# Altium project cyberlamp.PrjPcb
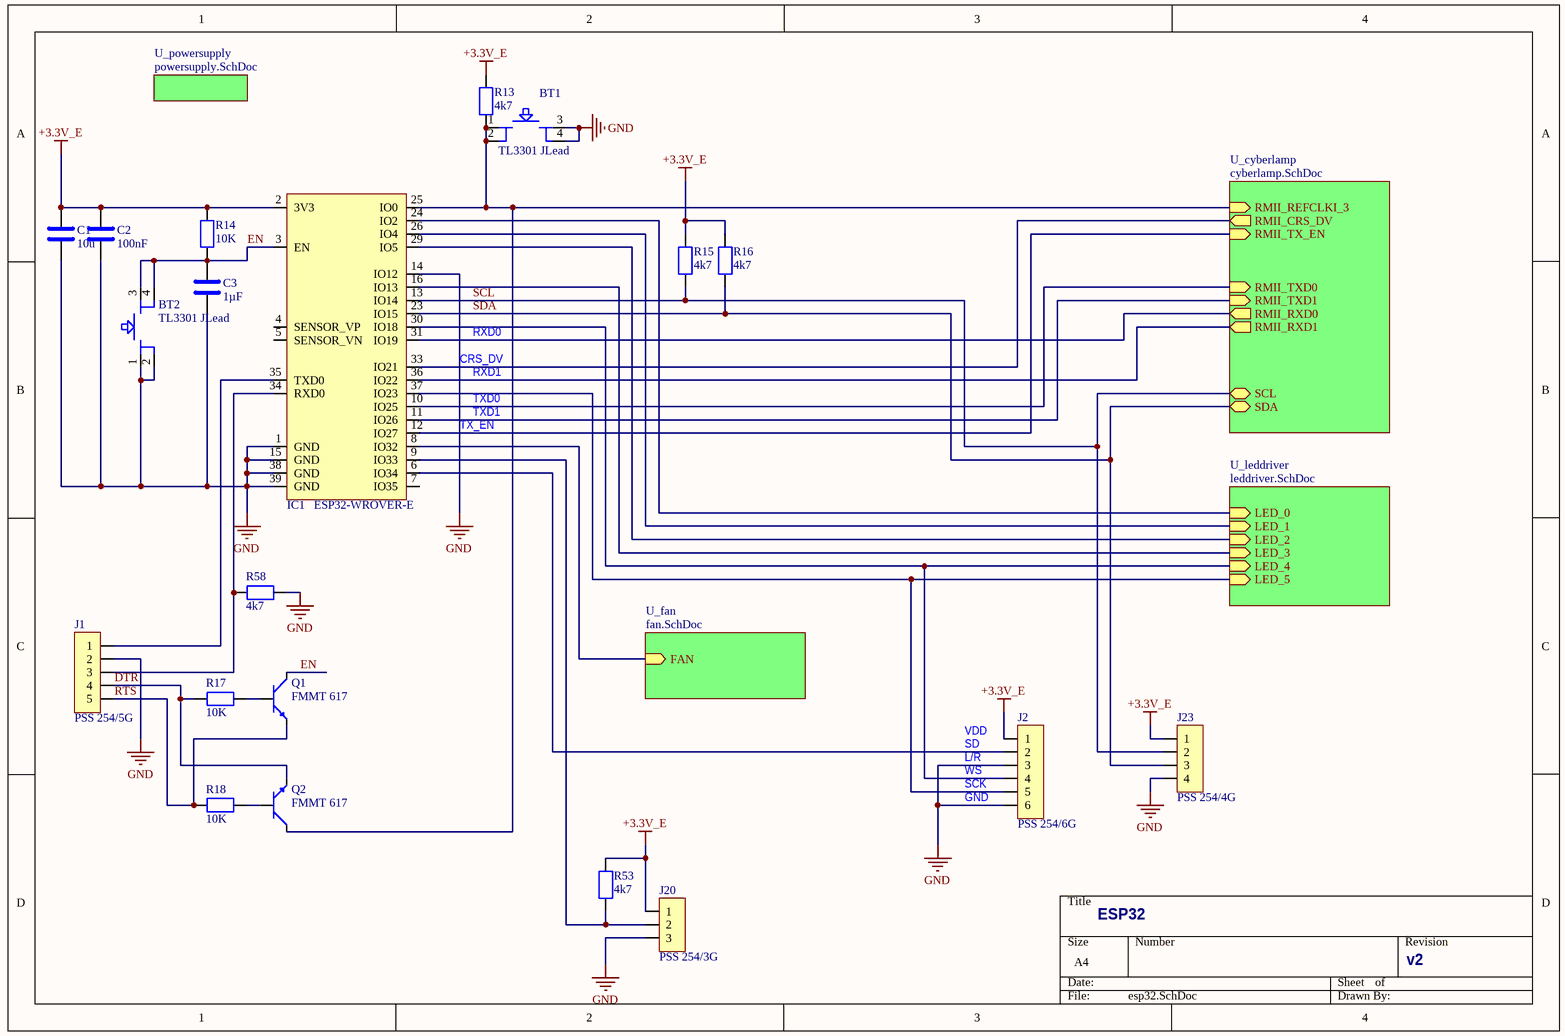
[diagram p0: esp32.SchDoc]
5 sheets, 173 parts. Net scope: hierarchical (ports join the sheet entries above them; power ports are global).
Board file: cyberlamp.PcbDoc
Sheets:
  esp32.SchDoc
    U_cyberlamp = cyberlamp.SchDoc
    U_leddriver = leddriver.SchDoc
    U_fan = fan.SchDoc
    U_powersupply = powersupply.SchDoc

## Sheet esp32.SchDoc
size A4; SheetNumber: 1; SheetTotal: 5

### Parts
BT1  TL3301 JLead  [TL3301_Jlead]
BT2  TL3301 JLead  [TL3301_Jlead]
C1  value 10u  [1210]  (hidden comment: 10uF 63V X7R 1210)
C2  value 100nF  [0603]  (hidden comment: 100nF 50V MLCC 0603)
C3  value 1µF  [0805]  (hidden comment: 1µF 25V MLCC 0805)
IC1  ESP32-WROVER-E  [ESP32-WROVER-I]
J1  PSS 254/5G  [PSS 5pol]
J2  PSS 254/6G  [PSS 6pol]
J20  PSS 254/3G  [PSS 3pol]
J23  PSS 254/4G  [PSS 4pol]
Q1  FMMT 617  [SOT-23]
Q2  FMMT 617  [SOT-23]
R13  value 4k7  [res0603]  (hidden comment: 4k7 100mW 0603)
R14  value 10K  [res0603]  (hidden comment: 10K 100mW 0603)
R15  value 4k7  [res0603]  (hidden comment: 4k7 100mW 0603)
R16  value 4k7  [res0603]  (hidden comment: 4k7 100mW 0603)
R17  value 10K  [res0603]  (hidden comment: 10K 100mW 0603)
R18  value 10K  [res0603]  (hidden comment: 10K 100mW 0603)
R53  value 4k7  [res0603]  (hidden comment: 4k7 100mW 0603)
R58  value 4k7  [res0603]  (hidden comment: 4k7 100mW 0603)

### Sub-sheets
U_cyberlamp = cyberlamp.SchDoc: RMII_REFCLKI_3 (in), RMII_TX_EN (in), RMII_TXD1 (in), RMII_TXD0 (in), RMII_CRS_DV (out), RMII_RXD1 (out), RMII_RXD0 (out), SCL (bidir), SDA (bidir)
U_fan = fan.SchDoc: FAN (in)
U_leddriver = leddriver.SchDoc: LED_0 (in), LED_1 (in), LED_2 (in), LED_3 (in), LED_4 (in), LED_5 (in)
U_powersupply = powersupply.SchDoc: no entries

### Nets
+3.3V_E: C1.1 C2.1 IC1.2(3V3) J2.1 J20.1 J23.1 R13.2 R14.2 R15.2 R16.2 R53.2
GND: BT1.3 BT1.4 BT2.1 BT2.2 C1.2 C2.2 C3.2 IC1.1(GND) IC1.14(IO12) IC1.15(GND) IC1.38(GND) IC1.39(GND) J1.2 J2.3 J2.6 J20.3 J23.4 R58.1
DTR: J1.4 Q2.2 R17.2
EN: BT2.3 BT2.4 C3.1 IC1.3(EN) Q1.3 R14.1
RTS: J1.5 Q1.2 R18.2
SCL: IC1.13(IO14) J23.2 R15.1 ; sheet U_cyberlamp/SCL
SDA: IC1.23(IO15) J23.3 R16.1 ; sheet U_cyberlamp/SDA
SMRXD30: IC1.10(IO25) ; sheet U_cyberlamp/RMII_TXD0
SMRXD31: IC1.11(IO26) ; sheet U_cyberlamp/RMII_TXD1
SMRXD33: BT1.1 BT1.2 IC1.25(IO0) Q2.3 R13.1 ; sheet U_cyberlamp/RMII_REFCLKI_3
SMRXDV3: IC1.12(IO27) ; sheet U_cyberlamp/RMII_TX_EN
NetIC1_6: IC1.6(IO34) J2.2
NetIC1_8: IC1.8(IO32) ; sheet U_fan/FAN
NetIC1_9: IC1.9(IO33) J20.2 R53.1
NetIC1_16: IC1.16(IO13) ; sheet U_leddriver/LED_3
NetIC1_24: IC1.24(IO2) ; sheet U_leddriver/LED_0
NetIC1_26: IC1.26(IO4) ; sheet U_leddriver/LED_1
NetIC1_29: IC1.29(IO5) ; sheet U_leddriver/LED_2
NetIC1_30: IC1.30(IO18) J2.4 ; sheet U_leddriver/LED_4
NetIC1_31: IC1.31(IO19) ; sheet U_cyberlamp/RMII_RXD0
NetIC1_33: IC1.33(IO21) ; sheet U_cyberlamp/RMII_CRS_DV
NetIC1_34: IC1.34(RXD0) J1.3 R58.2
NetIC1_35: IC1.35(TXD0) J1.1
NetIC1_36: IC1.36(IO22) ; sheet U_cyberlamp/RMII_RXD1
NetIC1_37: IC1.37(IO23) J2.5 ; sheet U_leddriver/LED_5
NetQ1_1: Q1.1 R17.1
NetQ2_1: Q2.1 R18.1

Not connected (* = marked no-connect by the designer): IC1 4(SENSOR_VP) 5(SENSOR_VN) 7(IO35)

### Notes on the sheet
- (near IC1) CRS_DV
- RXD0
- RXD1
- (near IC1) TX_EN
- TXD0
- TXD1
- (near J2) VDD
- (near J2) SD
- (near J2) L/R
- (near J2) WS
- (near J2) SCK
- (near J2) GND
- ESP32
- v2

### Library data of the parts
BT1 BT2 = TK3301_jlead: TL3301 J-Lead button
C2 = 100nF 50V MLCC 0603: Reichelt code: X7R-G0603 100N; dielectricum: X7R; voltage: 50V; mouser code: 80-C0603X104K3R; storage: AIDTEKBox | Röhrchen; storageID: 18 | F7; lcsc code: C2252264
C3 = 1µF 25V MLCC 0805: Reichelt code: KEM X5R0805 1,0U; dielectricum: X5R; voltage: 25V; lcsc code: C35795; mouser code: 187-CL21B105KAFNFNE; storage: AIDETEK; storageID: 181
IC1 = ESP32-WROVER-E-N16R2: mouser code: 356-ESP32WRVREN16R2
J1 = PSS 254/5G: PSS 5pol wire-to-board-connector; reichelt code: PSS 254/5G
J2 = PSS 254/6G: PSS 6pol wire-to-board-connector; reichelt code: PSS 254/6G
J20 = PSS 254/3G: PSS 3pol wire-to-board-connector; reichelt code: PSS 254/3G
J23 = PSS 254/4G: PSS 4pol wire-to-board-connector; reichelt code: PSS 254/4G
Q1 Q2 = FMMT 617: NPN switching Transistor, 3A; reichelt code: FMMT 617 TA; mouser code: 522-FMMT617TA; storage: Box 1; storageID: 64
R14 R17 R18 = 10K 100mW 0603: Tolerance: 1%; Reichelt code: SMD-0603 10K; Power rating: 100mW; mouser code: 603-RE0603FRE0710KL; storage: AIDTEKBox; storageID: 4
C1 = 10uF 63V X7R 1210: mouser part: 81-GRM32ER71J106MA2L; voltage: 63V; lcsc code: C703129
R13 R15 R16 R53 R58 = 4k7 100mW 0603: mouser code: 603-RE0603FRE074K7L; Power rating: 100mW; storage: AIDTEKBox; storageID: 5

## Sheet cyberlamp.SchDoc
size A3; SheetNumber: 2; SheetTotal: 5
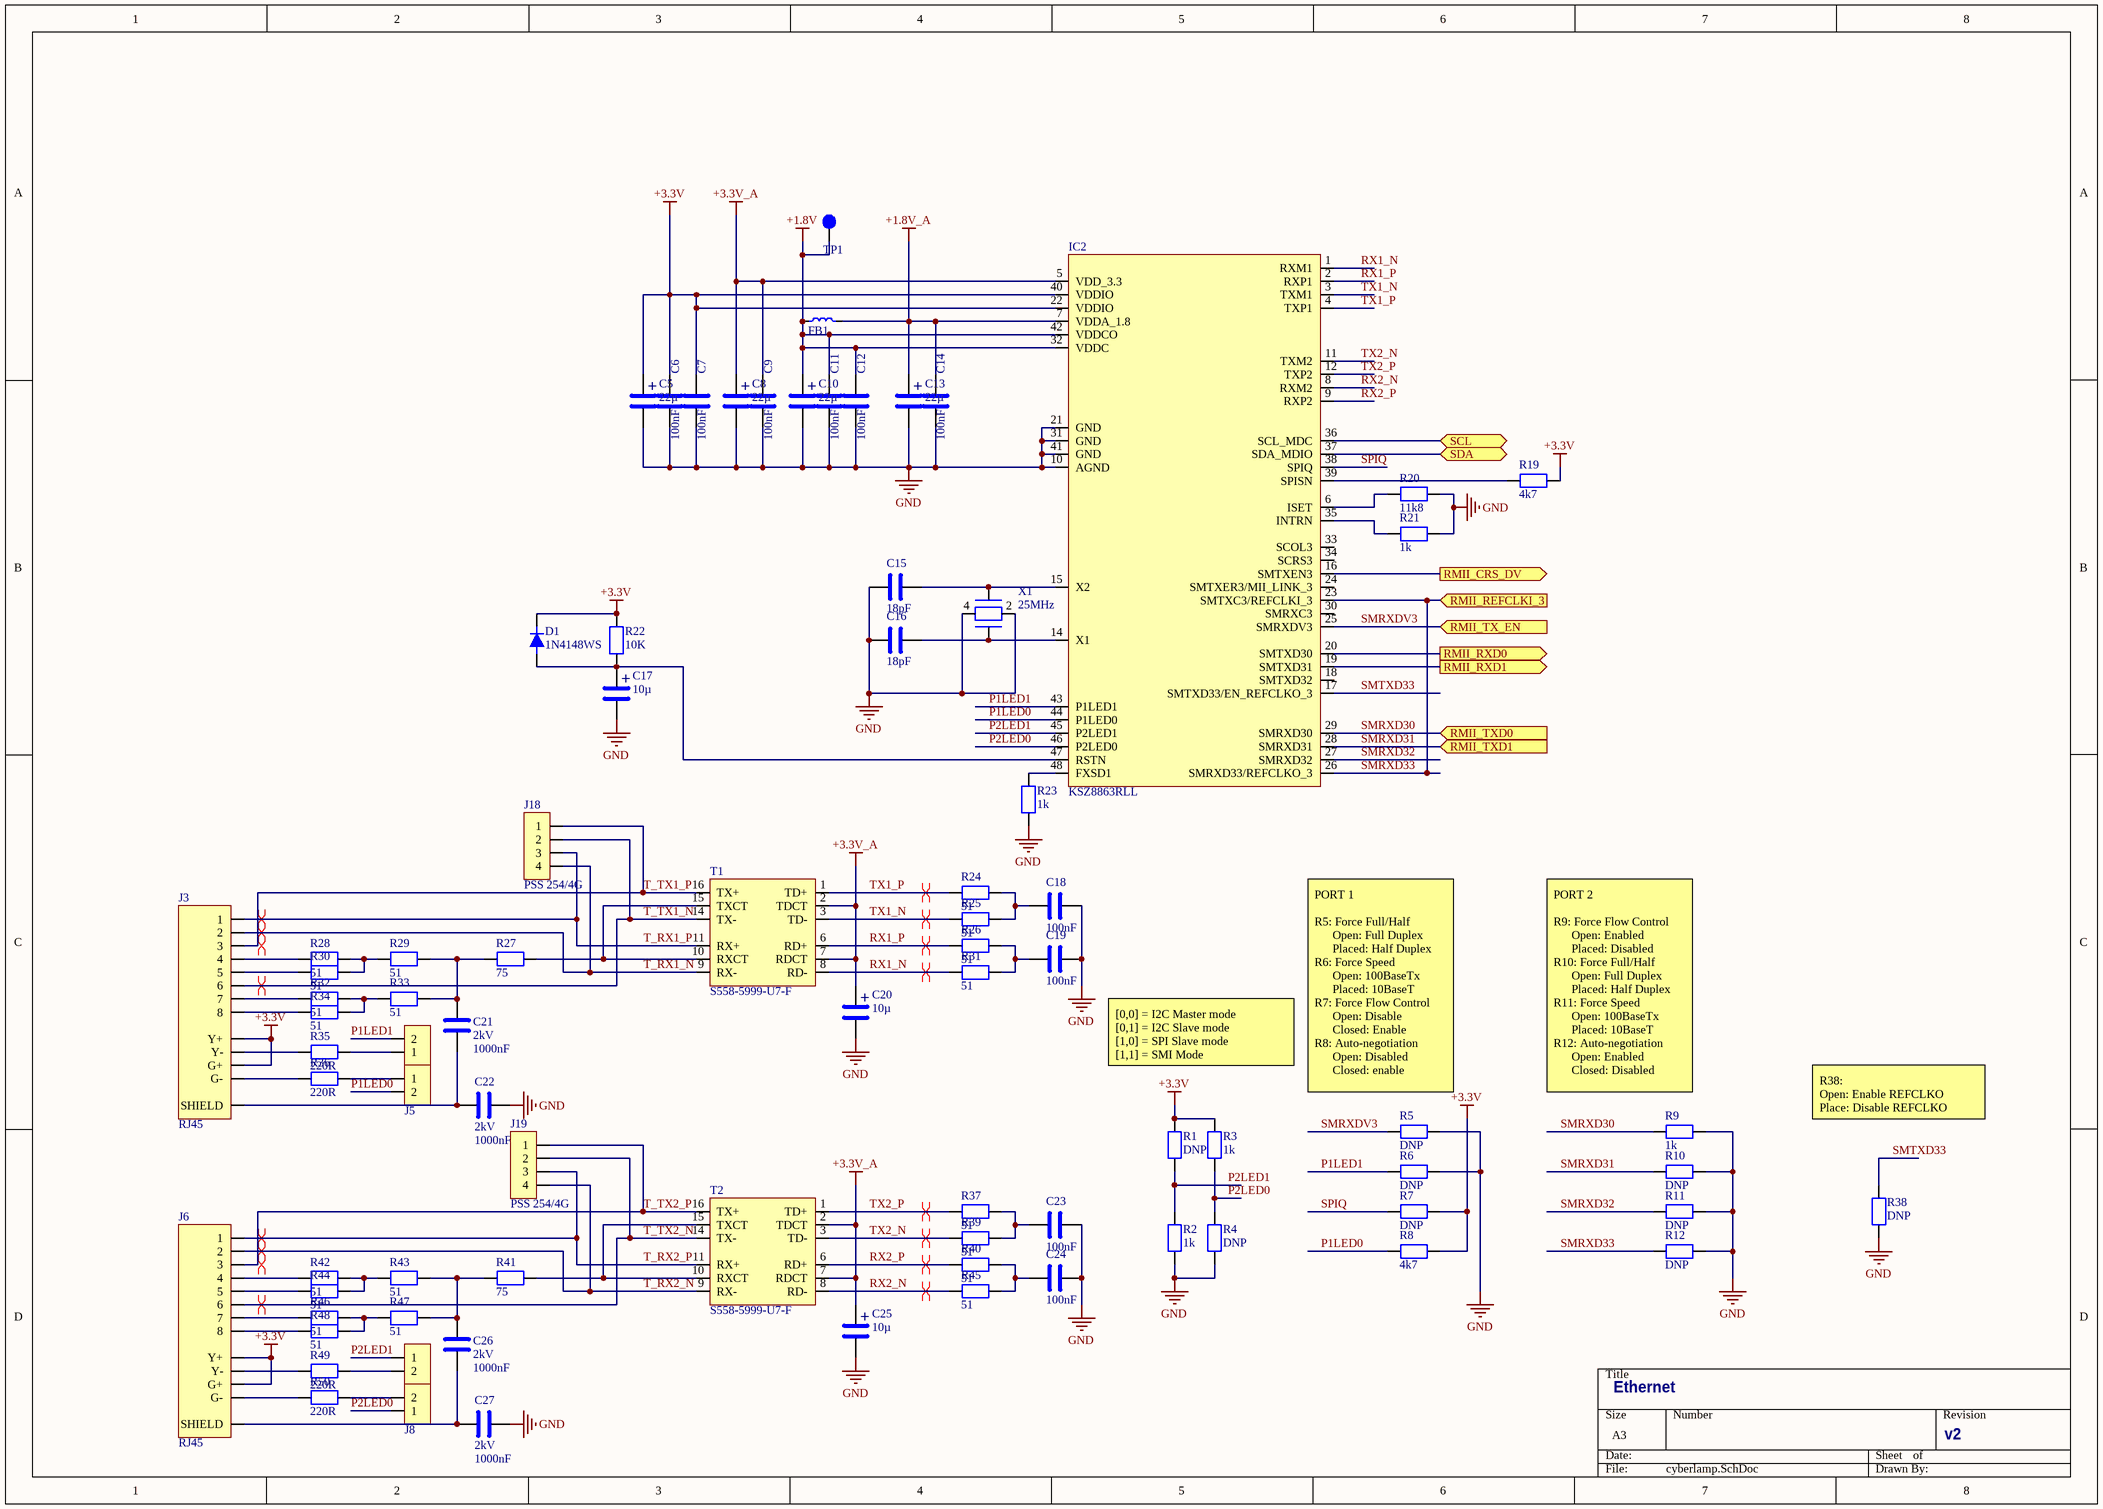
[diagram p1: cyberlamp.SchDoc]

### Parts
C5  value 22µ  [WCAP-ASLU]  (hidden comment: Elko 22µF 6.3V WE)
C6  value 100nF  [0603]  (hidden comment: 100nF 50V MLCC 0603)
C7  value 100nF  [0603]  (hidden comment: 100nF 50V MLCC 0603)
C8  value 22µ  [WCAP-ASLU]  (hidden comment: Elko 22µF 6.3V WE)
C9  value 100nF  [0603]  (hidden comment: 100nF 50V MLCC 0603)
C10  value 22µ  [WCAP-ASLU]  (hidden comment: Elko 22µF 6.3V WE)
C11  value 100nF  [0603]  (hidden comment: 100nF 50V MLCC 0603)
C12  value 100nF  [0603]  (hidden comment: 100nF 50V MLCC 0603)
C13  value 22µ  [WCAP-ASLU]  (hidden comment: Elko 22µF 6.3V WE)
C14  value 100nF  [0603]  (hidden comment: 100nF 50V MLCC 0603)
C15  value 18pF  [0603]  (hidden comment: 18pF 50V MLCC 0603)
C16  value 18pF  [0603]  (hidden comment: 18pF 50V MLCC 0603)
C17  value 10µ  [Panasonic_b]  (hidden comment: Elko_10uF_16V_PanasonicB)
C18  value 100nF  [0603]  (hidden comment: 100nF 50V MLCC 0603)
C19  value 100nF  [0603]  (hidden comment: 100nF 50V MLCC 0603)
C20  value 10µ  [Panasonic_b]  (hidden comment: Elko_10uF_16V_PanasonicB)
C21  value 1000nF  voltage: 2kV  [1206]  (hidden comment: NP0)
C22  value 1000nF  voltage: 2kV  [1206]  (hidden comment: NP0)
C23  value 100nF  [0603]  (hidden comment: 100nF 50V MLCC 0603)
C24  value 100nF  [0603]  (hidden comment: 100nF 50V MLCC 0603)
C25  value 10µ  [Panasonic_b]  (hidden comment: Elko_10uF_16V_PanasonicB)
C26  value 1000nF  voltage: 2kV  [1206]  (hidden comment: NP0)
C27  value 1000nF  voltage: 2kV  [1206]  (hidden comment: NP0)
D1  1N4148WS  [SOD323]
FB1  HI1206N101R-10  [1206]  (value not drawn)
IC2  KSZ8863RLL  [LQFP48]
J3  RJ45  [MTJ-88ARX1-FSM-PG-LH]
J4  SL 1X2G 2,54  [SL_1x2 2.54mm]  (value not drawn)
J5  SL 1X2G 2,54  [SL_1x2 2.54mm]  (value not drawn)
J6  RJ45  [MTJ-88ARX1-FSM-PG-LH]
J7  SL 1X2G 2,54  [SL_1x2 2.54mm]  (value not drawn)
J8  SL 1X2G 2,54  [SL_1x2 2.54mm]  (value not drawn)
J18  PSS 254/4G  [PSS 4pol]
J19  PSS 254/4G  [PSS 4pol]
R1  value DNP  [res0603]  (hidden comment: 1k 100mW 0603)
R2  value 1k  [res0603]  (hidden comment: 1k 100mW 0603)
R3  value 1k  [res0603]  (hidden comment: 1k 100mW 0603)
R4  value DNP  [res0603]  (hidden comment: 1k 100mW 0603)
R5  value DNP  [res0603]  (hidden comment: 1k 100mW 0603)
R6  value DNP  [res0603]  (hidden comment: 1k 100mW 0603)
R7  value DNP  [res0603]  (hidden comment: 4k7 100mW 0603)
R8  value 4k7  [res0603]  (hidden comment: 4k7 100mW 0603)
R9  value 1k  [res0603]  (hidden comment: 1k 100mW 0603)
R10  value DNP  [res0603]  (hidden comment: 1k 100mW 0603)
R11  value DNP  [res0603]  (hidden comment: 1k 100mW 0603)
R12  value DNP  [res0603]  (hidden comment: 1k 100mW 0603)
R19  value 4k7  [res0603]  (hidden comment: 4k7 100mW 0603)
R20  value 11k8  [res0603]  (hidden comment: 11k8 100mW 0603)
R21  value 1k  [res0603]  (hidden comment: 1k 100mW 0603)
R22  value 10K  [res0603]  (hidden comment: 10K 100mW 0603)
R23  value 1k  [res0603]  (hidden comment: 1k 100mW 0603)
R24  value 51  [res0603]  (hidden comment: 51R 100mW 0603)
R25  value 51  [res0603]  (hidden comment: 51R 100mW 0603)
R26  value 51  [res0603]  (hidden comment: 51R 100mW 0603)
R27  value 75  [res0603]  (hidden comment: 75R 100mW 0603)
R28  value 51  [res0603]  (hidden comment: 51R 100mW 0603)
R29  value 51  [res0603]  (hidden comment: 51R 100mW 0603)
R30  value 51  [res0603]  (hidden comment: 51R 100mW 0603)
R31  value 51  [res0603]  (hidden comment: 51R 100mW 0603)
R32  value 51  [res0603]  (hidden comment: 51R 100mW 0603)
R33  value 51  [res0603]  (hidden comment: 51R 100mW 0603)
R34  value 51  [res0603]  (hidden comment: 51R 100mW 0603)
R35  value 220R  [res0603]  (hidden comment: 220R 100mW 0603)
R36  value 220R  [res0603]  (hidden comment: 220R 100mW 0603)
R37  value 51  [res0603]  (hidden comment: 51R 100mW 0603)
R38  value DNP  [res0603]  (hidden comment: 1k 100mW 0603)
R39  value 51  [res0603]  (hidden comment: 51R 100mW 0603)
R40  value 51  [res0603]  (hidden comment: 51R 100mW 0603)
R41  value 75  [res0603]  (hidden comment: 75R 100mW 0603)
R42  value 51  [res0603]  (hidden comment: 51R 100mW 0603)
R43  value 51  [res0603]  (hidden comment: 51R 100mW 0603)
R44  value 51  [res0603]  (hidden comment: 51R 100mW 0603)
R45  value 51  [res0603]  (hidden comment: 51R 100mW 0603)
R46  value 51  [res0603]  (hidden comment: 51R 100mW 0603)
R47  value 51  [res0603]  (hidden comment: 51R 100mW 0603)
R48  value 51  [res0603]  (hidden comment: 51R 100mW 0603)
R49  value 220R  [res0603]  (hidden comment: 220R 100mW 0603)
R50  value 220R  [res0603]  (hidden comment: 220R 100mW 0603)
T1  S558-5999-U7-F  [S558-5999-U7-F]
T2  S558-5999-U7-F  [S558-5999-U7-F]
TP1  testpoint  [testpoint]  (value not drawn)
X1  25MHz  [ABM8]

### Ports
RMII_CRS_DV (out), RMII_REFCLKI_3 (in), RMII_RXD0 (out), RMII_RXD1 (out), RMII_TX_EN (in), RMII_TXD0 (in), RMII_TXD1 (in), SCL (bidir), SDA (bidir)

### Nets
+1.8V: C10.+ C11.1 C12.1 FB1.1 IC2.32(VDDC) IC2.42(VDDCO) TP1.1
+1.8V_A: C13.+ C14.1 FB1.2 IC2.7(VDDA_1.8)
+3.3V: C5.+ C6.1 C7.1 D1.1 IC2.22(VDDIO) IC2.40(VDDIO) J3.10(Y+) J3.12(G+) J6.10(Y+) J6.12(G+) R1.2 R3.2 R7.1 R8.1 R19.1 R22.2
+3.3V_A: C8.+ C9.1 C20.+ C25.+ IC2.5(VDD_3.3) T1.2(TDCT) T1.7(RDCT) T2.2(TDCT) T2.7(RDCT)
GND: C5.- C6.2 C7.2 C8.- C9.2 C10.- C11.2 C12.2 C13.- C14.2 C15.1 C16.1 C17.- C18.2 C19.2 C20.- C22.1 C23.2 C24.2 C25.- C27.1 IC2.10(AGND) IC2.21(GND) IC2.31(GND) IC2.41(GND) R2.1 R4.1 R5.1 R6.1 R9.1 R10.1 R11.1 R12.1 R20.1 R21.1 R23.2 R38.2 X1.2 X1.4
P1LED0: IC2.44(P1LED0) J5.2 R8.2
P1LED1: IC2.43(P1LED1) J4.2 R6.2
P2LED0: IC2.46(P2LED0) J8.1 R3.1 R4.2
P2LED1: IC2.45(P2LED1) J7.1 R1.1 R2.2
RX1_N: IC2.1(RXM1) R31.2 T1.8(RD-)
RX1_P: IC2.2(RXP1) R26.2 T1.6(RD+)
RX2_N: IC2.8(RXM2) R45.2 T2.8(RD-)
RX2_P: IC2.9(RXP2) R40.2 T2.6(RD+)
SCL: IC2.36(SCL_MDC) ; port SCL
SDA: IC2.37(SDA_MDIO) ; port SDA
SMRXD30: IC2.29(SMRXD30) R9.2 ; port RMII_TXD0
SMRXD31: IC2.28(SMRXD31) R10.2 ; port RMII_TXD1
SMRXD32: IC2.27(SMRXD32) R11.2
SMRXD33: IC2.23(SMTXC3/REFCLKI_3) IC2.26(SMRXD33/REFCLKO_3) R12.2 ; port RMII_REFCLKI_3
SMRXDV3: IC2.25(SMRXDV3) R5.2 ; port RMII_TX_EN
SMTXD33: IC2.17(SMTXD33/EN_REFCLKO_3) R38.1
SPIQ: IC2.38(SPIQ) R7.2
T_RX1_N: J3.2 J18.4 T1.9(RX-)
T_RX1_P: J3.1 J18.3 T1.11(RX+)
T_RX2_N: J6.2 J19.4 T2.9(RX-)
T_RX2_P: J6.1 J19.3 T2.11(RX+)
T_TX1_N: J3.6 J18.2 T1.14(TX-)
T_TX1_P: J3.3 J18.1 T1.16(TX+)
T_TX2_N: J6.6 J19.2 T2.14(TX-)
T_TX2_P: J6.3 J19.1 T2.16(TX+)
TX1_N: IC2.3(TXM1) R25.2 T1.3(TD-)
TX1_P: IC2.4(TXP1) R24.2 T1.1(TD+)
TX2_N: IC2.11(TXM2) R39.2 T2.3(TD-)
TX2_P: IC2.12(TXP2) R37.2 T2.1(TD+)
NetC15_2: C15.2 IC2.15(X2) X1.1
NetC16_2: C16.2 IC2.14(X1) X1.3
NetC17_+: C17.+ D1.2 IC2.47(RSTN) R22.1
NetC18_1: C18.1 R24.1 R25.1
NetC19_1: C19.1 R26.1 R31.1
NetC21_1: C21.1 C22.2 J3.13(SHIELD)
NetC21_2: C21.2 R27.2 R29.1 R33.1
NetC23_1: C23.1 R37.1 R39.1
NetC24_1: C24.1 R40.1 R45.1
NetC26_1: C26.1 C27.2 J6.13(SHIELD)
NetC26_2: C26.2 R41.2 R43.1 R47.1
NetIC1_31: IC2.20(SMTXD30) ; port RMII_RXD0
NetIC1_33: IC2.16(SMTXEN3) ; port RMII_CRS_DV
NetIC1_36: IC2.19(SMTXD31) ; port RMII_RXD1
NetIC2_6: IC2.6(ISET) R20.2
NetIC2_35: IC2.35(INTRN) R21.2
NetIC2_39: IC2.39(SPISN) R19.2
NetIC2_48: IC2.48(FXSD1) R23.1
NetJ3_4: J3.4 R28.2
NetJ3_5: J3.5 R30.2
NetJ3_7: J3.7 R32.2
NetJ3_8: J3.8 R34.2
NetJ3_9: J3.9(Y-) R35.2
NetJ3_11: J3.11(G-) R36.2
NetJ4_1: J4.1 R35.1
NetJ5_1: J5.1 R36.1
NetJ6_4: J6.4 R42.2
NetJ6_5: J6.5 R44.2
NetJ6_7: J6.7 R46.2
NetJ6_8: J6.8 R48.2
NetJ6_9: J6.9(Y-) R49.2
NetJ6_11: J6.11(G-) R50.2
NetJ7_2: J7.2 R49.1
NetJ8_2: J8.2 R50.1
NetR27_1: R27.1 T1.10(RXCT) T1.15(TXCT)
NetR28_1: R28.1 R29.2 R30.1
NetR32_1: R32.1 R33.2 R34.1
NetR41_1: R41.1 T2.10(RXCT) T2.15(TXCT)
NetR42_1: R42.1 R43.2 R44.1
NetR46_1: R46.1 R47.2 R48.1

Not connected (* = marked no-connect by the designer): IC2 18(SMTXD32) 24(SMTXER3/MII_LINK_3) 30(SMRXC3) 33(SCOL3) 34(SCRS3)

### Layout directives
differential pair: RX1_N, RX1_P, RX2_N, RX2_P, T_RX1_N, T_RX1_P, T_RX2_N, T_RX2_P, T_TX1_N, T_TX1_P, T_TX2_N, T_TX2_P, TX1_N, TX1_P, TX2_N, TX2_P

### Notes on the sheet
- [0,0] = I2C Master mode
  [0,1] = I2C Slave mode
  [1,0] = SPI Slave mode
  [1,1] = SMI Mode
- (near R5) PORT 1
  R5: Force Full/Half
  Open: Full Duplex
  Placed: Half Duplex
  R6: Force Speed
  Open: 100BaseTx
  Placed: 10BaseT
  R7: Force Flow Control
  Open: Disable
  Closed: Enable
  R8: Auto-negotiation
  Open: Disabled
  Closed: enable
- (near R9) PORT 2
  R9: Force Flow Control
  Open: Enabled
  Placed: Disabled
  R10: Force Full/Half
  Open: Full Duplex
  Placed: Half Duplex
  R11: Force Speed
  Open: 100BaseTx
  Placed: 10BaseT
  R12: Auto-negotiation
  Open: Enabled
  Closed: Disabled
- R38:
  Open: Enable REFCLKO
  Place: Disable REFCLKO
- Ethernet
- v2

### Library data of the parts
C6 C7 C9 C11 C12 C14 C18 C19 C23 C24 = 100nF 50V MLCC 0603: as C2 on sheet esp32; voltage: 50V; mouser code: 80-C0603X104K3R; storage: AIDTEKBox | Röhrchen; storageID: 18 | F7; lcsc code: C2252264
C15 C16 = 18pF 50V MLCC 0603: dielectricum: C0G; mouser code: 603-CC0603JRNPABN180; voltage: 50V; storageID: 179
C17 C20 C25 = Elko_10uF_16V_PanasonicB: voltage: 16V; mouser code: EEEHB1C100R
C21 C22 C26 C27 = 1000nF 2kV X7R 1206: mouser code: 710-885342208024
D1 = 1N4148WS: Small signal diode; mouser code: 512-1N4148WS; storage: AIDETEK; storageID: 189
FB1 = HI1206N101R-10: 3A ferrit bead; mouser code: 875-HI1206N101R-10; storage: AIDETEK; storageIDE: 188
IC2 = KSZ8863RLL: Dual port ethernet switch with RMII; mouser code: 998-KSZ8863RLL
J3 J6 = MTJ-88ARX1-FSM-PG-LH: RJ45, shielded with LED; mouser code: 737-MTJ88ARX1FSMPGLH
J4 J5 J7 J8 = SL 1X2G 2,54: Stiftleiste 2pol 2.54mm; reichelt code: SL 1X50G 2,54
J18 J19 = PSS 254/4G: PSS 4pol wire-to-board-connector; reichelt code: PSS 254/4G
R1-R6 R9-R12 R21 R23 R38 = 1k 100mW 0603: Tolerance: 1%; Reichelt code: SMD-0603 1K; Power rating: 100mW; storage: Röhrchen; storageID: B1
R20 = 11k8 100mW 0603: Tolerance: 1%; mouser code: 603-RT0603DRE0711K8L; Power rating: 100mW; storage: AIDTEKBox; storageID: 177
R22 = 10K 100mW 0603: as R14 on sheet esp32; Power rating: 100mW; mouser code: 603-RE0603FRE0710KL; storage: AIDTEKBox; storageID: 4
R24-R26 R28-R34 R37 R39 R40 R42-R48 = 51R 100mW 0603: 51 100mW 0603; Tolerance: 5%; AIDTEKBox: 176; mouser code: 791-WR06X510JTR; Power rating: 100mW; storage: AIDETEK; storageID: 176
R27 R41 = 75R 100mW 0603: 75 100mW 0603; Tolerance: 1%; mouser code: 603-RC0603FR-7W75RL; Power rating: 100mW
R35 R36 R49 R50 = 220R 100mW 0603: Tolerance: 1%; Power rating: 100mW; storage: Röhrchen; storageID: I8
T1 T2 = S558-5999-U7-F: Ethernet transformer; mouser code: 530-S558-5999-U7-F
X1 = ABM8-25.000MHZ-B2-T: ABM8 25MHz crystal; mouser code: 815-ABM8-25-B2-T; storage: AIDETEK; storageID: 187
C5 C8 C10 C13 = Elko 22µF 6.3V WE: voltage: 6.3V; mouser code: 710-865090168010
R7 R8 R19 = 4k7 100mW 0603: mouser code: 603-RE0603FRE074K7L; Power rating: 100mW; storage: AIDTEKBox; storageID: 5

## Sheet leddriver.SchDoc
size A4; SheetNumber: 4; SheetTotal: 5
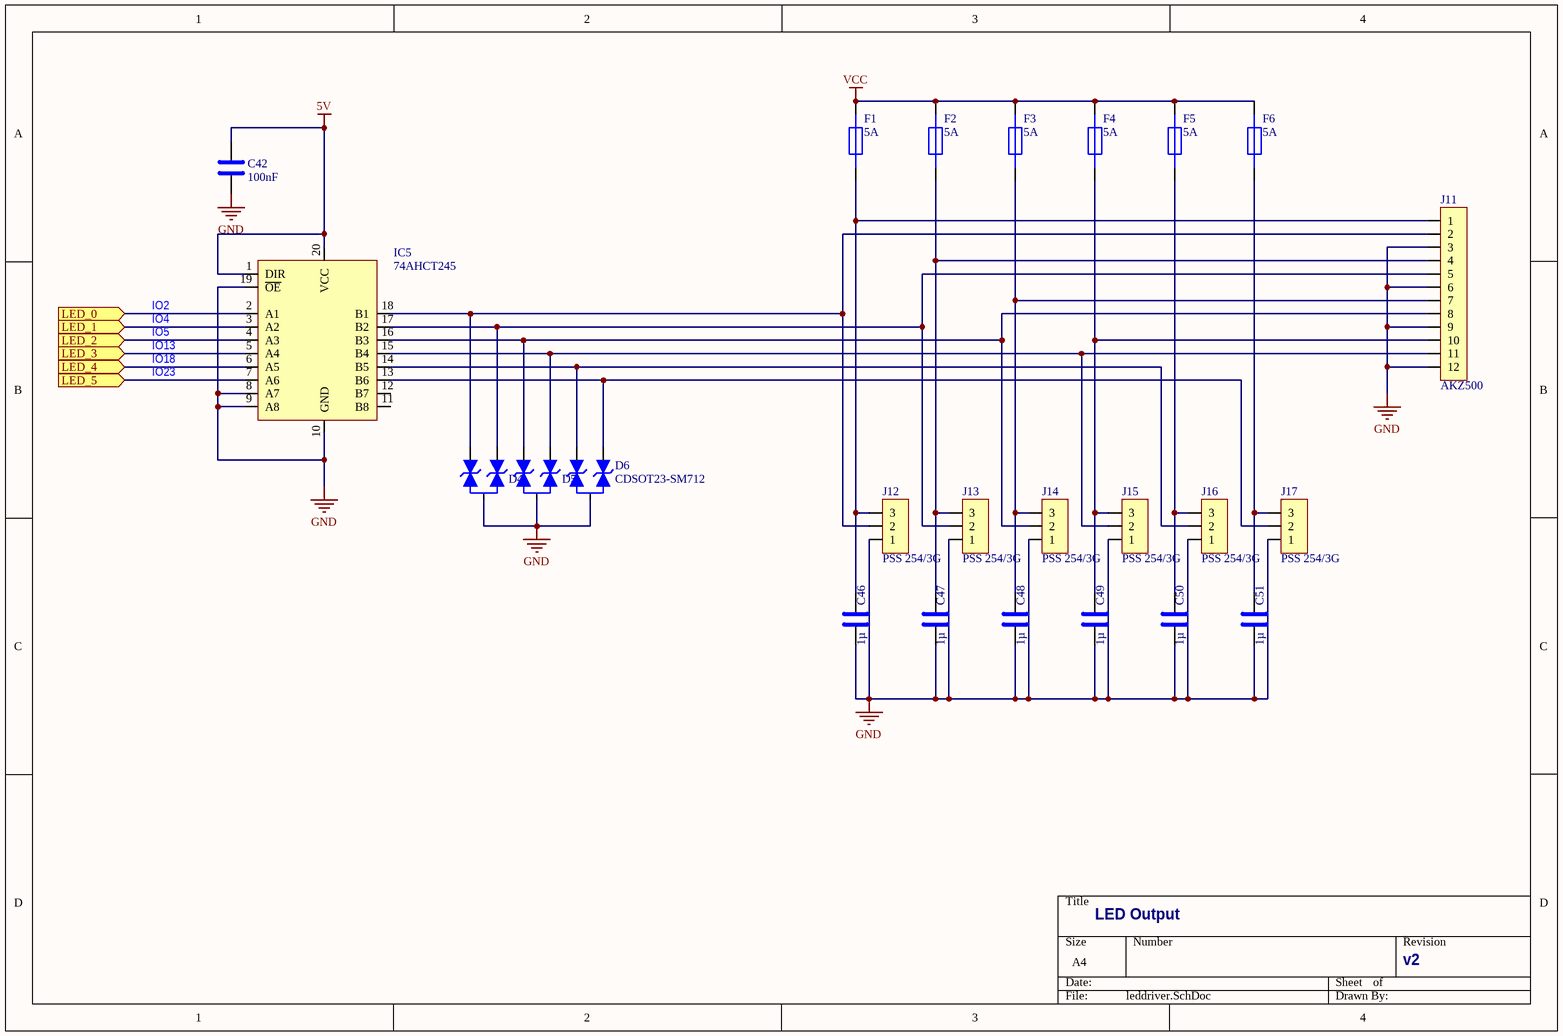
[diagram p2: leddriver.SchDoc]

### Parts
C42  value 100nF  [0603]  (hidden comment: 100nF 50V MLCC 0603)
C46  value 1µ  [1206]  (hidden comment: 1µF 50V MLCC 1206)
C47  value 1µ  [1206]  (hidden comment: 1µF 50V MLCC 1206)
C48  value 1µ  [1206]  (hidden comment: 1µF 50V MLCC 1206)
C49  value 1µ  [1206]  (hidden comment: 1µF 50V MLCC 1206)
C50  value 1µ  [1206]  (hidden comment: 1µF 50V MLCC 1206)
C51  value 1µ  [1206]  (hidden comment: 1µF 50V MLCC 1206)
D4  CDSOT23-SM712  [SOT23]  (value not drawn)
D5  CDSOT23-SM712  [SOT23]  (value not drawn)
D6  CDSOT23-SM712  [SOT23]
F1  5A  [1206]
F2  5A  [1206]
F3  5A  [1206]
F4  5A  [1206]
F5  5A  [1206]
F6  5A  [1206]
IC5  74AHCT245  [TSSOP20]
J11  AKZ500  [AKZ500/12]
J12  PSS 254/3G  [PSS 3pol]
J13  PSS 254/3G  [PSS 3pol]
J14  PSS 254/3G  [PSS 3pol]
J15  PSS 254/3G  [PSS 3pol]
J16  PSS 254/3G  [PSS 3pol]
J17  PSS 254/3G  [PSS 3pol]

### Ports
LED_0 (in), LED_1 (in), LED_2 (in), LED_3 (in), LED_4 (in), LED_5 (in)

### Nets
5V: C42.1 IC5.1(DIR) IC5.20(VCC)
GND: C42.2 C46.2 C47.2 C48.2 C49.2 C50.2 C51.2 D4.3 D5.3 D6.3 IC5.8(A7) IC5.9(A8) IC5.10(GND) IC5.19(~{OE}) J11.3 J11.6 J11.9 J11.12 J12.1 J13.1 J14.1 J15.1 J16.1 J17.1
VCC: F1.2 F2.2 F3.2 F4.2 F5.2 F6.2
NetC46_1: C46.1 F1.1 J11.1 J12.3
NetC47_1: C47.1 F2.1 J11.4 J13.3
NetC48_1: C48.1 F3.1 J11.7 J14.3
NetC49_1: C49.1 F4.1 J11.10 J15.3
NetC50_1: C50.1 F5.1 J16.3
NetC51_1: C51.1 F6.1 J17.3
NetD4_1: D4.1 IC5.18(B1) J11.2 J12.2
NetD4_2: D4.2 IC5.17(B2) J11.5 J13.2
NetD5_1: D5.1 IC5.16(B3) J11.8 J14.2
NetD5_2: D5.2 IC5.15(B4) J11.11 J15.2
NetD6_1: D6.1 IC5.14(B5) J16.2
NetD6_2: D6.2 IC5.13(B6) J17.2
NetIC1_16: IC5.5(A4) ; port LED_3
NetIC1_24: IC5.2(A1) ; port LED_0
NetIC1_26: IC5.3(A2) ; port LED_1
NetIC1_29: IC5.4(A3) ; port LED_2
NetIC1_30: IC5.6(A5) ; port LED_4
NetIC1_37: IC5.7(A6) ; port LED_5

Not connected (* = marked no-connect by the designer): IC5 11(B8) 12(B7)

### Notes on the sheet
- IO2
- IO4
- IO5
- IO13
- IO18
- IO23
- LED Output
- v2

### Library data of the parts
C42 = 100nF 50V MLCC 0603: as C2 on sheet esp32; voltage: 50V; mouser code: 80-C0603X104K3R; storage: AIDTEKBox | Röhrchen; storageID: 18 | F7; lcsc code: C2252264
C46-C51 = 1µF 50V MLCC 1206: dielectricum: X7R; mouser code: 810-C3216X7R1H105K; voltage: 50V
D4-D6 = CDSOT23-SM712: Dual TVS diode; mouser code: 652-CDSOT23-SM712
F1-F6 = Fuse_1206_5A: Fuse, 1206, 5A, 63V; mouser code: 530-C1T5
IC5 = SN74AHCT245: Octal Tristate Bus driver; mouser code: 595-SN74AHCT245PWRE4; storage: AIDETEK; storageID: 193
J11 = AKZ500/12: mouser code: 845-34.112
J12-J17 = PSS 254/3G: PSS 3pol wire-to-board-connector; reichelt code: PSS 254/3G

## Sheet fan.SchDoc
size A4; SheetNumber: 5; SheetTotal: 5
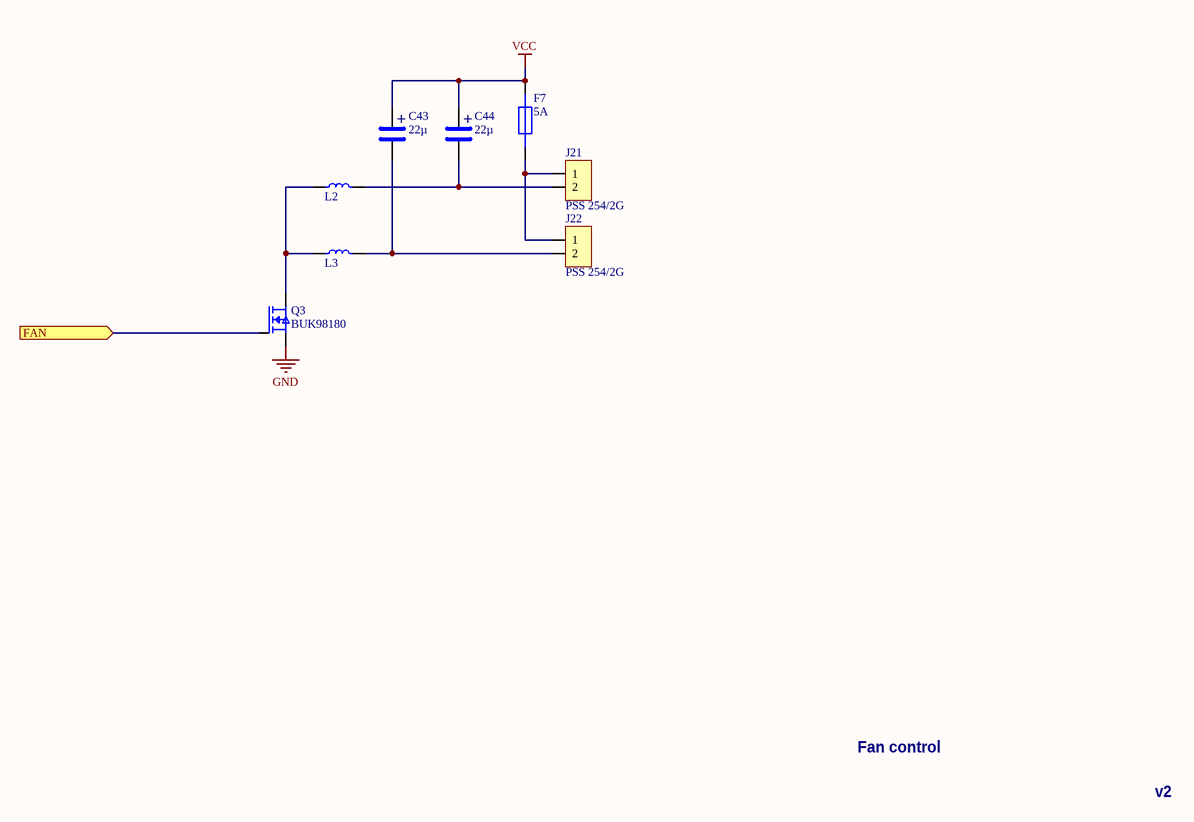
[diagram p3: fan.SchDoc]

### Parts
C43  value 22µ  [WCAP-ASLU]  (hidden comment: Elko 22µF 6.3V WE)
C44  value 22µ  [WCAP-ASLU]  (hidden comment: Elko 22µF 6.3V WE)
F7  5A  [1206]
J21  PSS 254/2G  [PSS 2pol]
J22  PSS 254/2G  [PSS 2pol]
L2  TDL_NL322522  [NL322522]  (value not drawn)
L3  TDL_NL322522  [NL322522]  (value not drawn)
Q3  BUK98180  [SOT223]

### Ports
FAN (in)

### Nets
GND: Q3.3
VCC: C43.+ C44.+ F7.2
NetC43_-: C43.- J22.2 L3.2
NetC44_-: C44.- J21.2 L2.2
NetF7_1: F7.1 J21.1 J22.1
NetIC1_8: Q3.1 ; port FAN
NetL2_1: L2.1 L3.1 Q3.2

### Notes on the sheet
- Fan control
- v2

### Library data of the parts
F7 = Fuse_1206_1A: Fuse, 1206, 1A, 63VDC / 63VAC; mouser code: 530-C1T1
J21 J22 = PSS 254/2G: PSS 2pol wire-to-board-connector; reichelt code: PSS 254/2G
Q3 = BUK98180-100A: N-FET 100V 4.6A logic level; mouser code: 771-BUK98180-100ACUX; storage: AIDETEK; storageID: 186
C43 C44 = Elko 22µF 6.3V WE: voltage: 6.3V; mouser code: 710-865090168010
L2 L3 = TDL_NL322522: storage: AIDETEK; storageID: 191

## Sheet powersupply.SchDoc: Voltage regulation
size A4; SheetNumber: 3; SheetTotal: 5
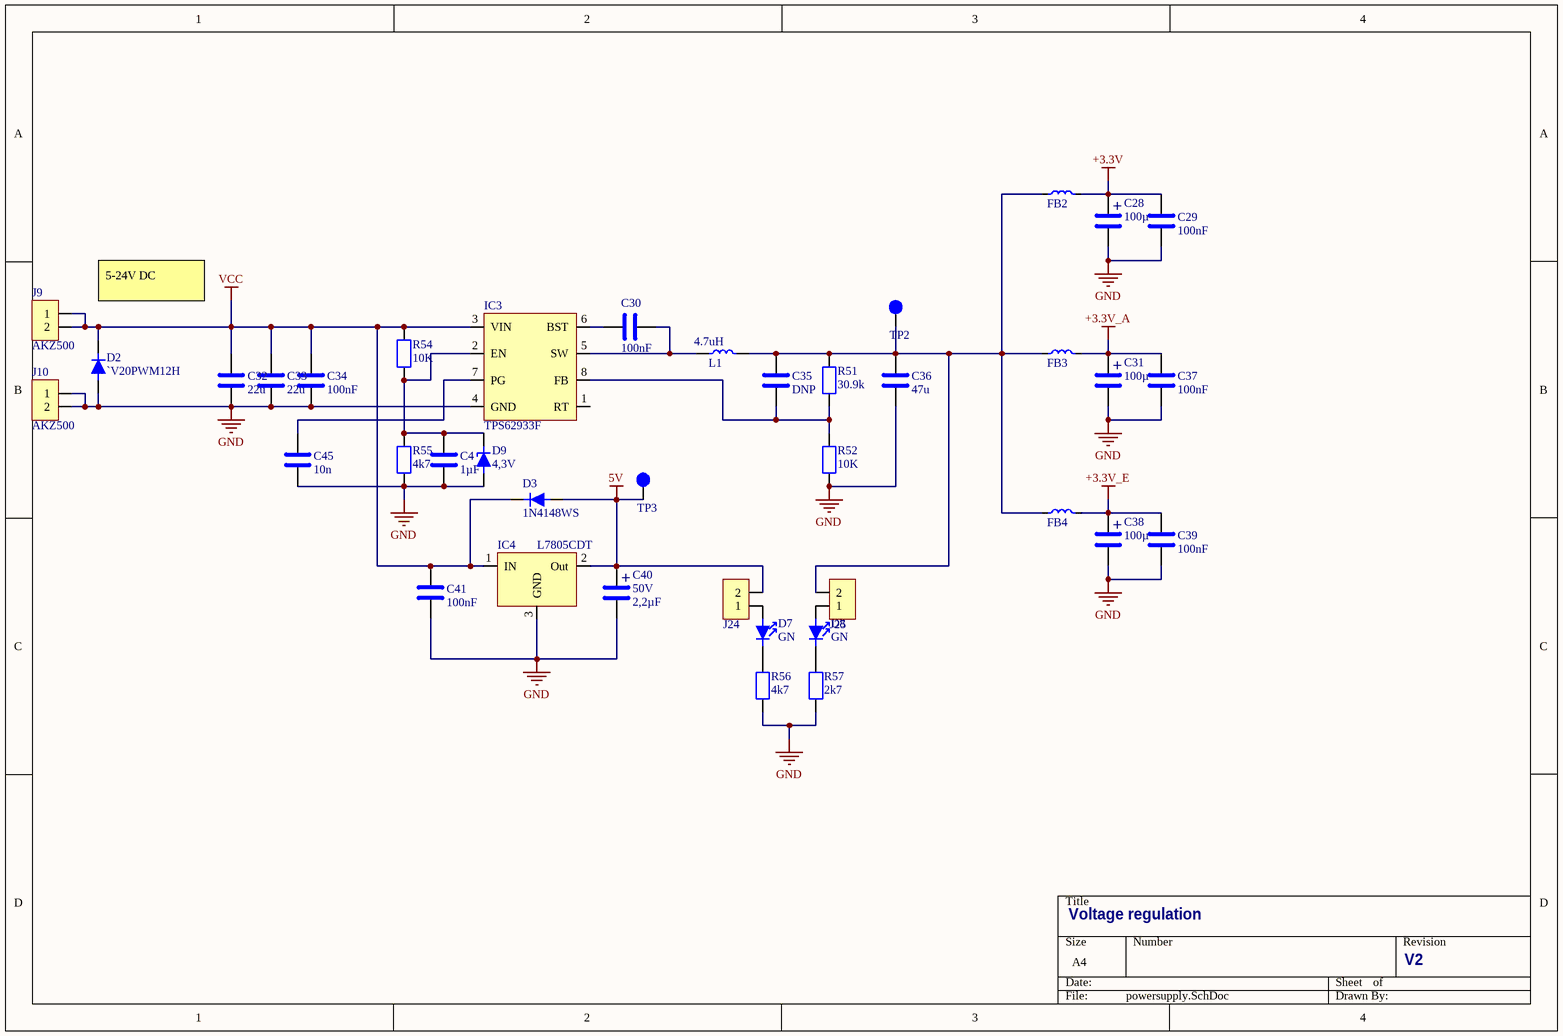
[diagram p4: powersupply.SchDoc]

### Parts
C4  value 1µF  [0805]  (hidden comment: 1µF 25V MLCC 0805)
C28  value 100µ  [PANASONIC_C]  (hidden comment: Elko_100uF_16V_PanasonicC)
C29  value 100nF  [0603]  (hidden comment: 100nF 50V MLCC 0603)
C30  value 100nF  [0603]  (hidden comment: 100nF 50V MLCC 0603)
C31  value 100µ  [PANASONIC_C]  (hidden comment: Elko_100uF_16V_PanasonicC)
C32  value 22u  [1210]  (hidden comment: 22uF 35V X5R 1210)
C33  value 22u  [1210]  (hidden comment: 22uF 35V X5R 1210)
C34  value 100nF  [0603]  (hidden comment: 100nF 50V MLCC 0603)
C35  value DNP  [0603]  (hidden comment: 47pF MLCC 0603)
C36  value 47u  [1210]  (hidden comment: 47uF 16V X7R 1210)
C37  value 100nF  [0603]  (hidden comment: 100nF 50V MLCC 0603)
C38  value 100µ  [PANASONIC_C]  (hidden comment: Elko_100uF_16V_PanasonicC)
C39  value 100nF  [0603]  (hidden comment: 100nF 50V MLCC 0603)
C40  voltage: 50V  capacitance: 2,2µF  [SIZE_B]  (hidden comment: 2,2µF 50V Size B Elko)
C41  value 100nF  [0603]  (hidden comment: 100nF 50V MLCC 0603)
C45  value 10n  [0603]  (hidden comment: 10nF 50V MLCC 0603)
D2  `V20PWM12H  [TO-252AE]
D3  1N4148WS  [SOD323]
D7  GN  [G0805]
D8  GN  [G0805]
D9  value 4,3V  [SOD323]  (hidden comment: BZT52-C4V3S_R1_00001)
FB2  HI1206N101R-10  [1206]  (value not drawn)
FB3  HI1206N101R-10  [1206]  (value not drawn)
FB4  HI1206N101R-10  [1206]  (value not drawn)
IC3  TPS62933F  [SOT583-8]
IC4  L7805CDT  [D-PAK]
J9  AKZ500  [AKZ500/2]
J10  AKZ500  [AKZ500/2]
J24  SL 1X2G 2,54  [SL_1x2 2.54mm]  (value not drawn)
J25  SL 1X2G 2,54  [SL_1x2 2.54mm]  (value not drawn)
L1  value 4.7uH  [BOURNS SRN5040]  (hidden comment: SRN5040-4R7M)
R51  value 30.9k  [res0603]  (hidden comment: 30k9 100mW 0603)
R52  value 10K  [res0603]  (hidden comment: 10K 100mW 0603)
R54  value 10K  [res0603]  (hidden comment: 10K 100mW 0603)
R55  value 4k7  [res0603]  (hidden comment: 4k7 100mW 0603)
R56  value 4k7  [res0603]  (hidden comment: 4k7 100mW 0603)
R57  value 2k7  [res0603]  (hidden comment: 2k7 100mW 0603)
TP2  testpoint  [testpoint]  (value not drawn)
TP3  testpoint  [testpoint]  (value not drawn)

### Nets
5V: C40.1 D3.2 IC4.2(Out) J24.2 TP3.1
+3.3V: C28.+ C29.1 FB2.2
+3.3V_A: C31.+ C37.1 FB3.2
+3.3V_E: C38.+ C39.1 FB4.2
GND: C4.2 C28.- C29.2 C31.- C32.2 C33.2 C34.2 C36.2 C37.2 C38.- C39.2 C40.2 C41.1 C45.2 D2.2 D9.2 IC3.4(GND) IC4.3(GND) J10.1 J10.2 R52.1 R55.1 R56.1 R57.1
VCC: C32.1 C33.1 C34.1 C41.2 D2.1 D3.1 IC3.3(VIN) IC4.1(IN) J9.1 J9.2 R54.2
NetC4_1: C4.1 D9.1 IC3.2(EN) R54.1 R55.2
NetC30_1: C30.1 IC3.6(BST)
NetC30_2: C30.2 IC3.5(SW) L1.1
NetC35_1: C35.1 C36.1 FB2.1 FB3.1 FB4.1 J25.2 L1.2 R51.2 TP2.1
NetC35_2: C35.2 IC3.8(FB) R51.1 R52.2
NetC45_1: C45.1 IC3.7(PG)
NetD7_1: D7.1 R56.2
NetD7_2: D7.2 J24.1
NetD8_1: D8.1 R57.2
NetD8_2: D8.2 J25.1

Not connected (* = marked no-connect by the designer): IC3 1(RT)

### Notes on the sheet
- 5-24V DC
- Voltage regulation
- V2
- (in symbol 2,2µF 50V Size B Elko) +

### Library data of the parts
C4 = 1µF 25V MLCC 0805: as C3 on sheet esp32; voltage: 25V; lcsc code: C35795; mouser code: 187-CL21B105KAFNFNE; storage: AIDETEK; storageID: 181
C28 C31 C38 = Elko_100uF_16V_PanasonicC: voltage: 16V; mouser code: 667-16SVPC100M
C29 C30 C34 C37 C39 C41 = 100nF 50V MLCC 0603: as C2 on sheet esp32; voltage: 50V; mouser code: 80-C0603X104K3R; storage: AIDTEKBox | Röhrchen; storageID: 18 | F7; lcsc code: C2252264
C35 = 47pF MLCC 0603: 680pF 50V MLCC 0603; dielectricum: NPO; lcsc code: C94904; mouser code: 187-CL10C470JC81PNC
C40 = 2,2µF 50V Size B Elko: reichelt code: VF 2,2/50 C-B
C45 = 10nF 50V MLCC 0603: Reichelt code: X7R-G0603 10N; dielectricum: X7R; voltage: 50V
D2 = V20PWM12HM3: 20A high power diode; mouser code: 78-V20PWM12HM3/I; storage: AIDETEK; storageID: 190
D3 = 1N4148WS: Small signal diode; mouser code: 512-1N4148WS; storage: AIDETEK; storageID: 189
D7 D8 = G0805 LED GN: If: 20mA; Vf: 2.2V; reichelt code: SMD-LED 0805 GN
D9 = BZT52C4V3SR10000: 4,3V Z-Diode; mouser code: 241-BZT52C4V3SR10000
FB2-FB4 = HI1206N101R-10: 3A ferrit bead; mouser code: 875-HI1206N101R-10; storage: AIDETEK; storageIDE: 188
IC4 = L7805CDT: 5V Spannungsregler D-PAK; mouser code: 511-L7805CDT-TR
J9 J10 = AKZ500/2: mouser code: 845-34.102
J24 J25 = SL 1X2G 2,54: as J4 on sheet cyberlamp
R51 = 30k9 100mW 0603: Tolerance: 1%; mouser code: 652-CR0603-FX3092ELF; Power rating: 100mW; storageID: 178; storage: AIDTEKBox
R52 R54 = 10K 100mW 0603: as R14 on sheet esp32; Power rating: 100mW; mouser code: 603-RE0603FRE0710KL; storage: AIDTEKBox; storageID: 4
R57 = 2k7 100mW 0603: Tolerance: 1%; Power rating: 100mW; mouser code: 603-RE0603FRE072K7L; storage: AIDTEKBox; storageID: 2
C32 C33 = 22uF 35V X5R 1210: voltage: 35V; mouser code: 963-GMK325BJ226MM-P; storage: AIDETEK; storageID: 183
C36 = 47uF 16V X7R 1210: mouser part: GRM32ER61C476KE15L; voltage: 16V; lcsc code: C77101; storage: AIDETEK; storageID: 184
IC3 = TPS62933F: mouser code: 595-TPS62933FDRLR; storage: AIDETEK; storageID: 185
L1 = SRN5040-4R7M: mouser code: 652-SRN5040-4R7M; storage: AIDETEK; storageID: 198
R55 R56 = 4k7 100mW 0603: mouser code: 603-RE0603FRE074K7L; Power rating: 100mW; storage: AIDTEKBox; storageID: 5

## Nets that join several sheets
5V: leddriver (C42.1 IC5.1 IC5.20), powersupply (5 pins)
+3.3V: cyberlamp (16 pins), powersupply (C28.+ C29.1 FB2.2)
+3.3V_A: cyberlamp (9 pins), powersupply (C31.+ C37.1 FB3.2)
+3.3V_E: esp32 (11 pins), powersupply (C38.+ C39.1 FB4.2)
GND: esp32 (18 pins), cyberlamp (39 pins), leddriver (24 pins), fan (Q3.3), powersupply (24 pins)
VCC: leddriver (6 pins), fan (C43.+ C44.+ F7.2), powersupply (11 pins)
NetIC1_8: esp32 (IC1.8), fan (Q3.1)
NetIC1_16: esp32 (IC1.16), leddriver (IC5.5)
NetIC1_24: esp32 (IC1.24), leddriver (IC5.2)
NetIC1_26: esp32 (IC1.26), leddriver (IC5.3)
NetIC1_29: esp32 (IC1.29), leddriver (IC5.4)
NetIC1_30: esp32 (IC1.30 J2.4), leddriver (IC5.6)
NetIC1_31: esp32 (IC1.31), cyberlamp (IC2.20)
NetIC1_33: esp32 (IC1.33), cyberlamp (IC2.16)
NetIC1_36: esp32 (IC1.36), cyberlamp (IC2.19)
NetIC1_37: esp32 (IC1.37 J2.5), leddriver (IC5.7)
SCL: esp32 (IC1.13 J23.2 R15.1), cyberlamp (IC2.36)
SDA: esp32 (IC1.23 J23.3 R16.1), cyberlamp (IC2.37)
SMRXD30: esp32 (IC1.10), cyberlamp (IC2.29 R9.2)
SMRXD31: esp32 (IC1.11), cyberlamp (IC2.28 R10.2)
SMRXD33: esp32 (5 pins), cyberlamp (IC2.23 IC2.26 R12.2)
SMRXDV3: esp32 (IC1.12), cyberlamp (IC2.25 R5.2)